# Altium schematic sheet Environmental Sensor.SchDoc: Environmental Sensor
size A4; SheetNumber: 1; SheetTotal: 3
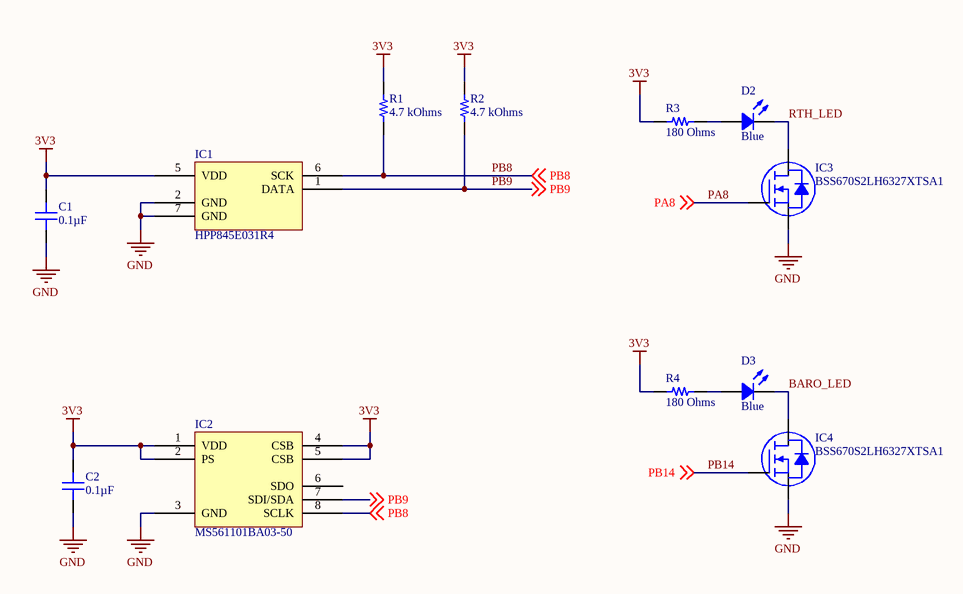
[diagram p0: Environmental Sensor.SchDoc]

## Parts
C1  0.1µF  [CAP 0603_1608]
C2  0.1µF  [CAP 0603_1608]
D2  Blue  [LED 0603_1608 BLUE]
D3  Blue  [LED 0603_1608 BLUE]
IC1  HPP845E031R4  [TE HPP845E031R4]
IC2  MS561101BA03-50  [MEAS SPEC MS5611-01BA03]
IC3  BSS670S2LH6327XTSA1  [INFINEON SOT-23-3]
IC4  BSS670S2LH6327XTSA1  [INFINEON SOT-23-3]
R1  4.7 kOhms  [RES 0603_1608]
R2  4.7 kOhms  [RES 0603_1608]
R3  180 Ohms  [RES 0603_1608]
R4  180 Ohms  [RES 0603_1608]

## Nets
3V3: C1.2 C2.2 IC1.5(VDD) IC2.1(VDD) IC2.2(PS) IC2.4(CSB) IC2.5(CSB) R1.2 R2.2 R3.1 R4.1
GND: C1.1 C2.1 IC1.2(GND) IC1.7(GND) IC2.3(GND) IC3.2(S) IC4.2(S)
BARO_LED: D3.2 IC4.3(D)
PA8: IC3.1(G) ; off-sheet PA8
PB8: IC1.6(SCK) IC2.8(SCLK) R1.1 ; off-sheet PB8
PB9: IC1.1(DATA) IC2.7(SDI/SDA) R2.1 ; off-sheet PB9
PB14: IC4.1(G) ; off-sheet PB14
RTH_LED: D2.2 IC3.3(D)
NetD2_1: D2.1 R3.2
NetD3_1: D3.1 R4.2

Not connected (* = marked no-connect by the designer): IC2 6(SDO)

## Notes on the sheet
- Title
- Size:
- Date:
- A4
- Number:
- Time:
- Revision:
- Sheet
- of
- File:

## Library data of the parts
C1 C2 = 06035C104JAT4A: CAP CER 0.1UF 50V X7R 0603; Manufacturer: AVX Corporation; Tolerance: ±5%; Part Number: 06035C104JAT4A; Value: 0.1µF; Applications: General Purpose; Capacitance: 0.1µF; ComponentLink1Description: Datasheet; ComponentLink1URL: http://datasheets.avx.com/X7RDielectric.pdf; ComponentLink2Description: DigiKey Link; ComponentLink2URL: http://digikey.com/product-detail/en/avx-corporation/06035C104JAT4A/478-12459-1-ND/9749311; Device Package: 0603 (1608 Metric); LastUpdated: 02/09/2020 01:03:34; Lifecycle Status: Active; Minimum Order: 1; Mounting Type: Surface Mount, MLCC; Operating Temperature: -55°C ~ 125°C; Package / Case: 0603 (1608 Metric); Packaging: TapeAndReel; PartId: 3002; Part Status: Active; Price: 0.01; Series: -; Size / Dimension: 0.063" L x 0.032" W (1.60mm x 0.81mm); Supplier 1: DigiKey; Supplier Part Number 1: 478-12459-1-ND; Temperature Coefficient: X7R; Thickness (Max): 0.035" (0.90mm); Voltage - Rated: 50V
D2 D3 = LTST-C193TBKT-5A: LED BLUE CLEAR CHIP SMD; Manufacturer: Lite-On Inc.; Configuration: Standard; Current - Test: 5mA; Lens Color: Colorless; Lens Size: 1.15mm x 0.80mm; Lens Style: Rectangle with Flat Top; Millicandela Rating: 15mcd; Viewing Angle: 130°; Voltage - Forward (Vf) (Typ): 2.8V; Wavelength - Dominant: 470nm; Wavelength - Peak: 468nm; Part Number: LTST-C193TBKT-5A; Color: Blue; ComponentLink1Description: Datasheet; ComponentLink1URL: //media.digikey.com/pdf/Data%20Sheets/Lite-On%20PDFs/LTST-C193TBKT-5A.pdf; ComponentLink2Description: DigiKey Link; ComponentLink2URL: http://digikey.com/product-detail/en/lite-on-inc/LTST-C193TBKT-5A/160-1827-1-ND/2355044; Device Package: 0603 (1608 Metric); Height (Max): 0.45mm; LastUpdated: 02/09/2020 01:20:25; Lens Transparency: Clear; Lifecycle Status: Active; Minimum Order: 1; Mounting Type: Surface Mount; Package / Case: 0603 (1608 Metric); Packaging: TapeAndReel; PartId: 829; Part Status: Active; Price: 0.06; Series: -; Size / Dimension: 1.60mm L x 0.80mm W; Supplier 1: DigiKey; Supplier Part Number 1: 160-1827-1-ND; Supplier Device Package: Chip LED; Value: Blue
IC1 = HPP845E031R4: SENSOR HUMID/TEMP 3V I2C 2% SMD; Manufacturer: TE Connectivity Measurement Specialties; Accuracy: ±2% RH; Humidity Range: 0 ~ 100% RH; Output: 12b; Output Type: I²C; Response Time: 5s; Sensor Type: Humidity, Temperature; Voltage - Supply: 1.5V ~ 3.6V; Part Number: HPP845E031R4; ComponentLink1Description: Datasheet; ComponentLink1URL: https://www.te.com/commerce/DocumentDelivery/DDEController?Action=srchrtrv&DocNm=HPC199_6&DocType=Data+Sheet&DocLang=English; ComponentLink2Description: DigiKey Link; ComponentLink2URL: http://digikey.com/product-detail/en/te-connectivity-measurement-specialties/HPP845E031R4/223-1144-1-ND/3945773; Device Package: 6-VDFN Exposed Pad; LastUpdated: 24/05/2020 22:55:13; Lifecycle Status: Active; Minimum Order: 1; Mounting Type: Surface Mount; Operating Temperature: -40°C ~ 125°C; Package / Case: 6-VDFN Exposed Pad; Packaging: TapeAndReel; Part Status: Active; Price: 2.87; Series: HTU; Supplier 1: DigiKey; Supplier Part Number 1: 223-1144-1-ND; Supplier Device Package: 6-DFN (3x3)
IC2 = MS561101BA03-50: BAROMETRIC PRESSURE SENSOR; Manufacturer: TE Connectivity Measurement Specialties; Accuracy: ±0.022PSI (±0.15kPa); Maximum Pressure: 87.02PSI (600kPa); Operating Pressure: 0.15PSI ~ 17.4PSI (1kPa ~ 120kPa); Output: 24 b; Output Type: I²C, SPI; Port Style: No Port; Pressure Type: Absolute; Voltage - Supply: 1.8V ~ 3.6V; Part Number: MS561101BA03-50; Applications: Board Mount; ComponentLink1Description: Datasheet; ComponentLink1URL: https://www.te.com/commerce/DocumentDelivery/DDEController?Action=srchrtrv&DocNm=MS5611-01BA03&DocType=Data+Sheet&DocLang=English; ComponentLink2Description: DigiKey Link; ComponentLink2URL: http://digikey.com/product-detail/en/te-connectivity-measurement-specialties/MS561101BA03-50/223-1622-1-ND/5277638; Device Package: 8-SMD; LastUpdated: 20/04/2020 15:54:53; Lifecycle Status: Active; Minimum Order: 1; Operating Temperature: -40°C ~ 85°C; Package / Case: 8-SMD; Packaging: Unknown; Part Status: Active; Price: 6.37; Series: -; Supplier 1: DigiKey; Supplier Part Number 1: 223-1622-1-ND; Termination Style: SMD (SMT) Tab
IC3 IC4 = BSS670S2LH6327XTSA1: MOSFET N-CH 55V 540MA SOT23; Manufacturer: Infineon Technologies; Current - Continuous Drain (Id) @ 25°C: 540mA (Ta); Drive Voltage (Max Rds On,  Min Rds On): 4.5V, 10V; FET Type: N-Channel; Gate Charge (Qg) (Max) @ Vgs: 2.26nC @ 10V; Input Capacitance (Ciss) (Max) @ Vds: 75pF @ 25V; Power Dissipation (Max): 360mW (Ta); Rds On (Max) @ Id, Vgs: 650mOhm @ 270mA, 10V; Vgs (Max): ±20V; Vgs(th) (Max) @ Id: 2V @ 2.7µA; Part Number: BSS670S2LH6327XTSA1; ComponentLink1Description: Datasheet; ComponentLink1URL: https://www.infineon.com/dgdl/BSS670S2L_Rev2.5.pdf?folderId=db3a3043156fd573011622e10b5c1f67&fileId=db3a304330f68606013109e4a7fb0094; ComponentLink2Description: DigiKey Link; ComponentLink2URL: http://digikey.com/product-detail/en/infineon-technologies/BSS670S2LH6327XTSA1/BSS670S2LH6327XTSA1CT-ND/3196653; Drain to Source Voltage (Vdss): 55V; LastUpdated: 02/09/2020 01:25:05; Lifecycle Status: Active; Minimum Order: 1; Mounting Type: Surface Mount; Operating Temperature: -55°C ~ 150°C (TJ); Package / Case: TO-236-3, SC-59, SOT-23-3; Packaging: TapeAndReel; Part Status: Active; Price: 0.07; Series: OptiMOS™; Supplier 1: DigiKey; Supplier Part Number 1: BSS670S2LH6327XTSA1CT-ND; Supplier Device Package: SOT-23-3; Technology: MOSFET (Metal Oxide)
R1 R2 = ERJ-3EKF4701V: RES SMD 4.7K OHM 1% 1/10W 0603; Manufacturer: Panasonic Electronic Components; Power (Watts): 0.1W, 1/10W; Temperature Coefficient: ±100ppm/°C; Part Number: ERJ-3EKF4701V; Value: 4.7 kOhms; ComponentLink1Description: Datasheet; ComponentLink1URL: https://industrial.panasonic.com/cdbs/www-data/pdf/RDA0000/AOA0000C304.pdf; ComponentLink2Description: DigiKey Link; ComponentLink2URL: http://digikey.com/product-detail/en/panasonic-electronic-components/ERJ-3EKF4701V/P4.70KHCT-ND/1746782; Composition: Thick Film; Device Package: 0603 (1608 Metric); Features: Automotive AEC-Q200; Height - Seated (Max): 0.022" (0.55mm); LastUpdated: 02/09/2020 01:10:23; Lifecycle Status: Active; Minimum Order: 1; Number of Terminations: 2; Operating Temperature: -55°C ~ 155°C; Package / Case: 0603 (1608 Metric); Packaging: TapeAndReel; PartId: 5645; Part Status: Active; Price: 0.01; Ratings: AEC-Q200; Resistance: 4.7 kOhms; Series: ERJ; Size / Dimension: 0.063" L x 0.031" W (1.60mm x 0.80mm); Supplier 1: DigiKey; Supplier Part Number 1: P4.70KHCT-ND; Supplier Device Package: 0603; Tolerance: ±1%
R3 R4 = ERJ-PA3J181V: RES SMD 180 OHM 5% 1/4W 0603; Manufacturer: Panasonic Electronic Components; Power (Watts): 0.25W, 1/4W; Temperature Coefficient: ±200ppm/°C; Part Number: ERJ-PA3J181V; Value: 180 Ohms; ComponentLink1Description: Datasheet; ComponentLink1URL: https://industrial.panasonic.com/cdbs/www-data/pdf/RDO0000/AOA0000C331.pdf; ComponentLink2Description: DigiKey Link; ComponentLink2URL: http://digikey.com/product-detail/en/panasonic-electronic-components/ERJ-PA3J181V/P180BZCT-ND/5036266; Composition: Thick Film; Device Package: 0603 (1608 Metric); Features: Automotive AEC-Q200, Pulse Withstanding; Height - Seated (Max): 0.022" (0.55mm); LastUpdated: 02/09/2020 01:09:49; Lifecycle Status: Active; Minimum Order: 1; Number of Terminations: 2; Operating Temperature: -55°C ~ 155°C; Package / Case: 0603 (1608 Metric); Packaging: TapeAndReel; PartId: 21551; Part Status: Active; Price: 0.01; Ratings: AEC-Q200; Resistance: 180 Ohms; Series: ERJ; Size / Dimension: 0.063" L x 0.031" W (1.60mm x 0.80mm); Supplier 1: DigiKey; Supplier Part Number 1: P180BZCT-ND; Supplier Device Package: 0603; Tolerance: ±5%